# Altium schematic sheet F143-MINI-KIT-902-FE-SMA_v1-0-2b.SchDoc: F143-MINI-KIT-902-FE-SMA_v1-0-2b
size 555 x 399 mm; Date: 4/13/2017 9:06:14 PM; SheetNumber: 1; REV: 1-0-2b
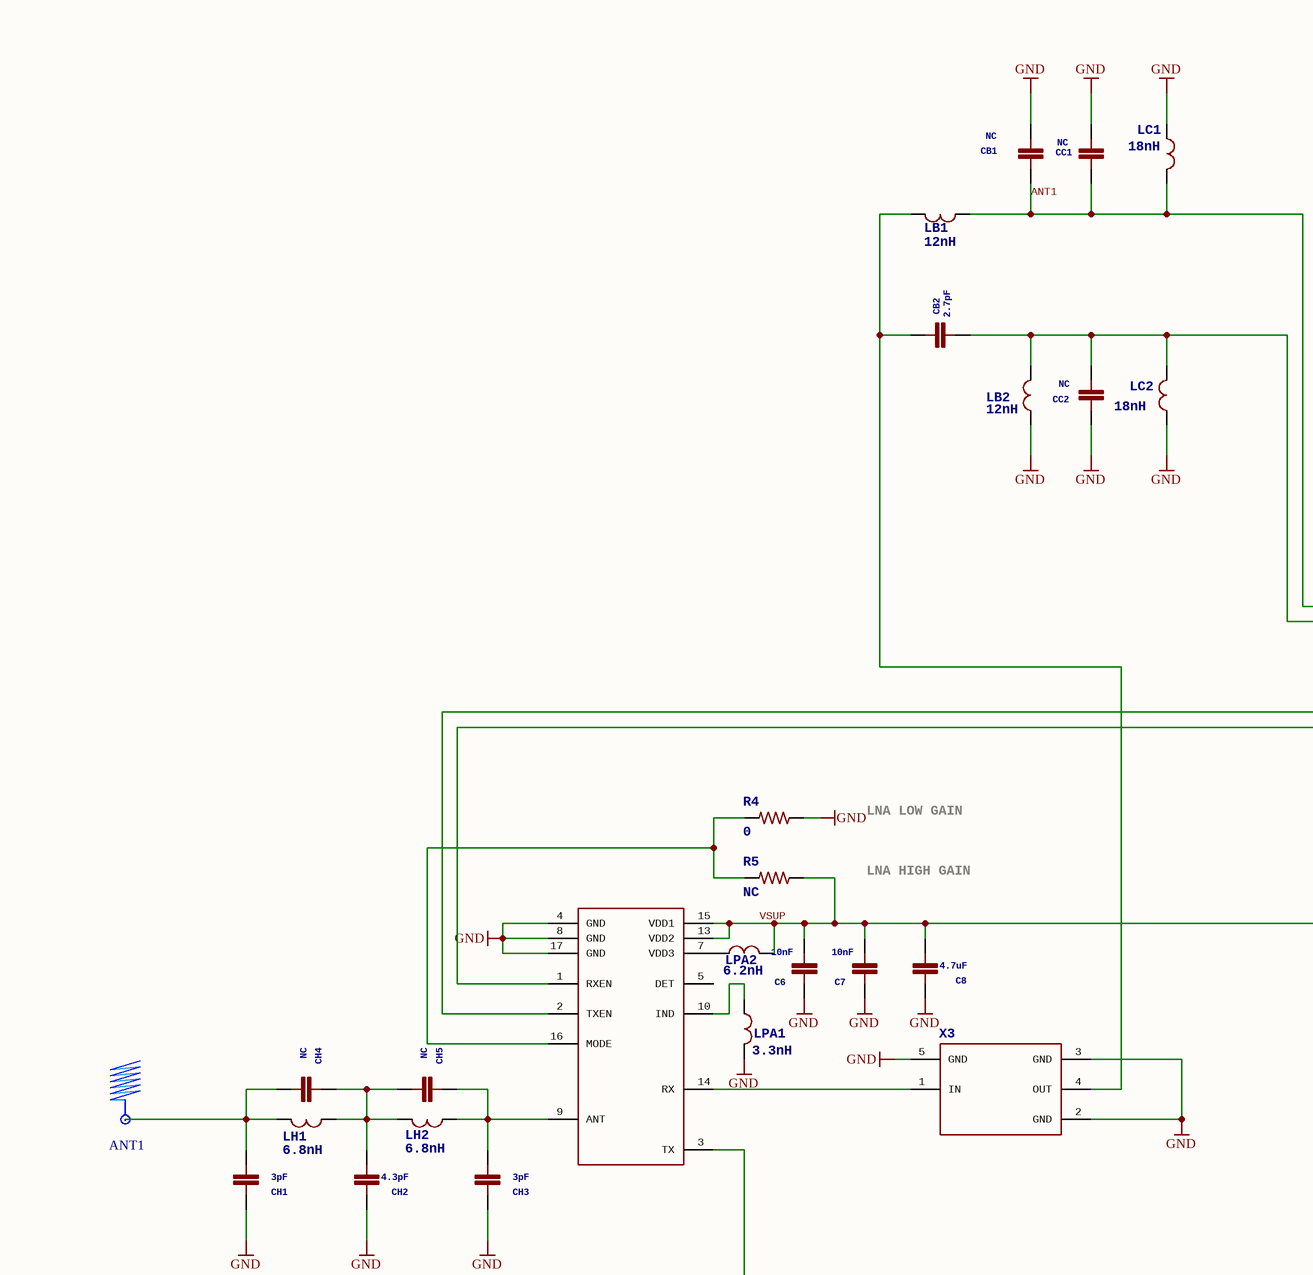
[diagram p0: F143-MINI-KIT-902-FE-SMA_v1-0-2b.SchDoc, top left]
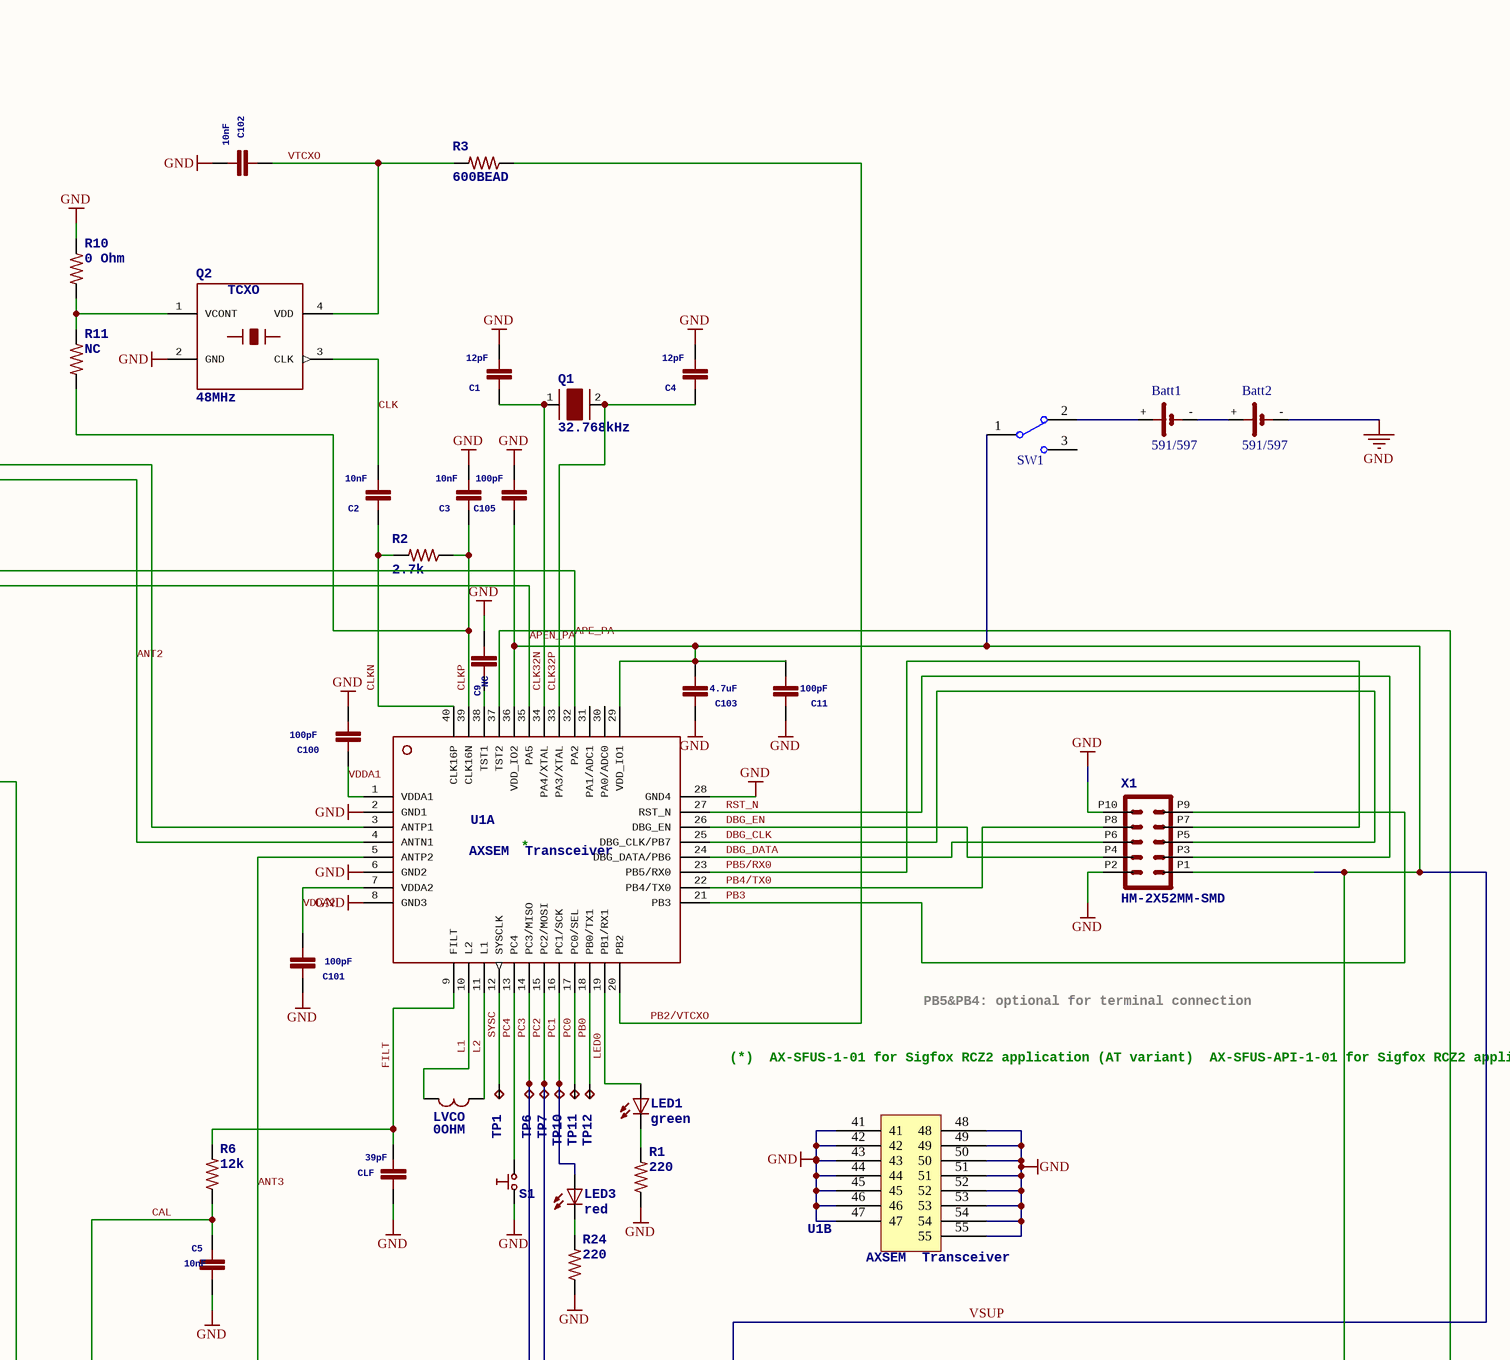
[diagram p1: F143-MINI-KIT-902-FE-SMA_v1-0-2b.SchDoc, top right]
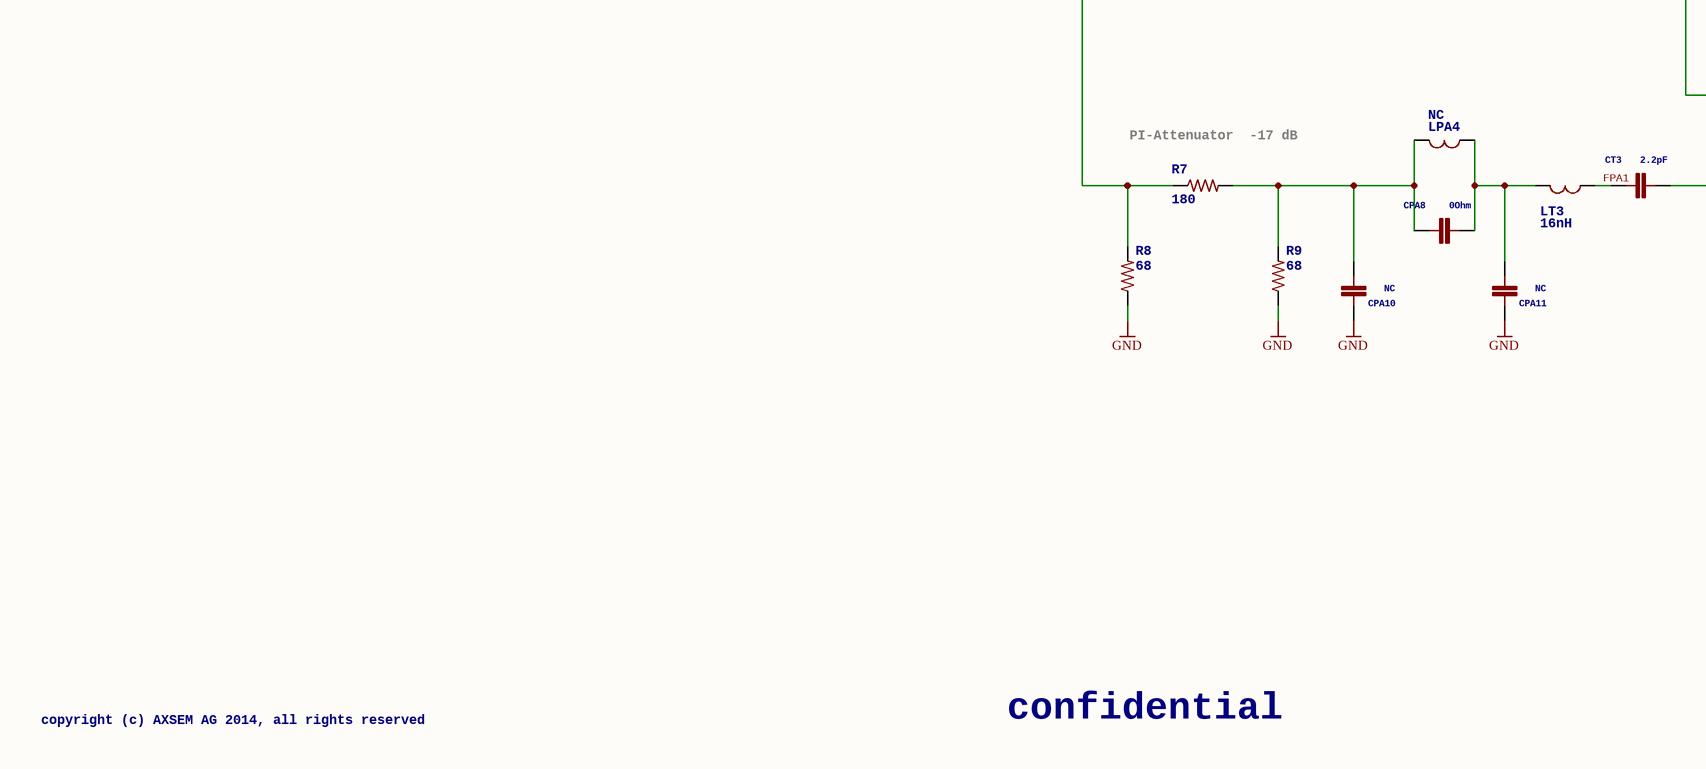
[diagram p2: F143-MINI-KIT-902-FE-SMA_v1-0-2b.SchDoc, bottom left]
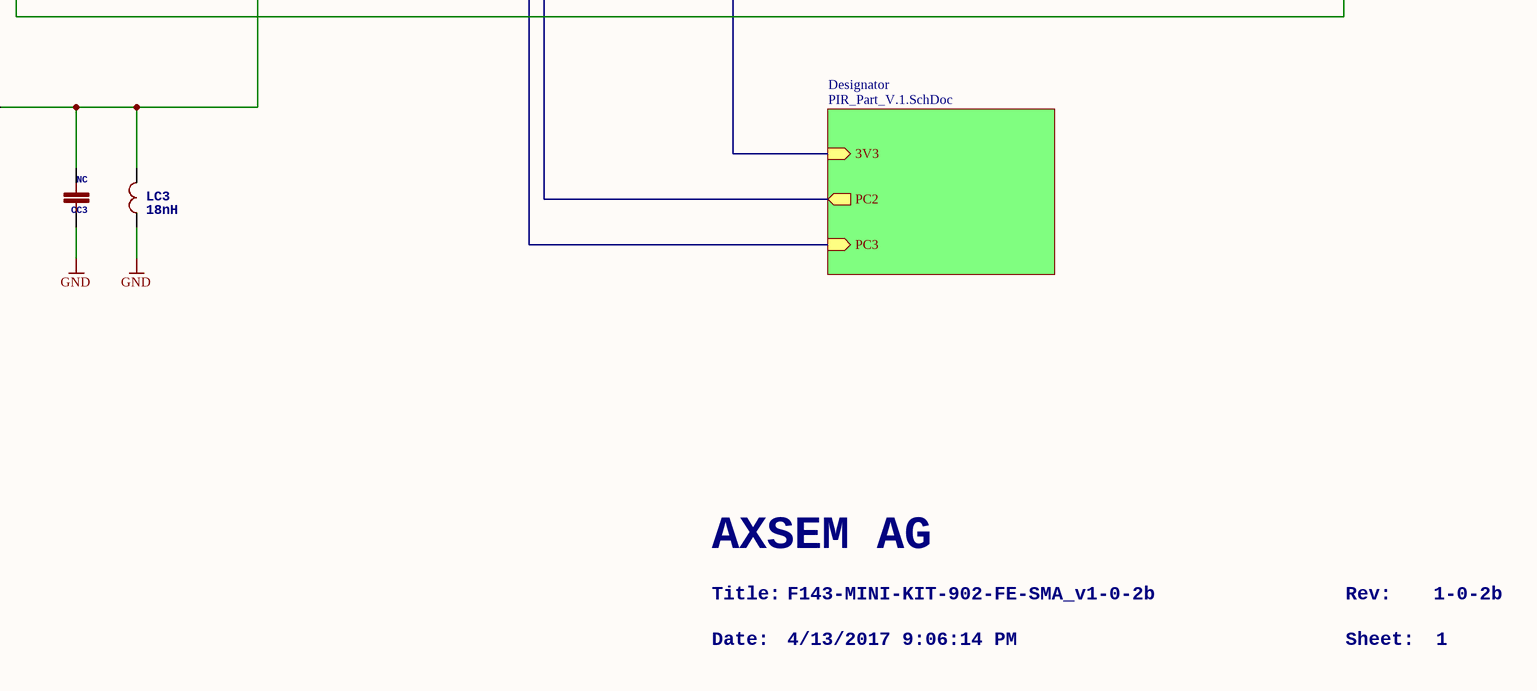
[diagram p3: F143-MINI-KIT-902-FE-SMA_v1-0-2b.SchDoc, bottom right]

## Parts
ANT1  SW868-TH13  [Spring Antenna]  (value not drawn)
Batt1  591/597  [Battery Clip AAA]
Batt2  591/597  [Battery Clip AAA]
C1  12pF  [C0402]
C2  10nF  [C0402]
C3  10nF  [C0402]
C4  12pF  [C0402]
C5  10nF  [C0402]
C6  10nF  [C0402]
C7  10nF  [C0402]
C8  4.7uF  [C0603]
C9  NC  [C0402]
C11  100pF  [C0402]
C100  100pF  [C0402]
C101  100pF  [C0402]
C102  10nF  [C0402]
C103  4.7uF  [C0603]
C105  100pF  [C0402]
CB1  NC  [C0402]
CB2  2.7pF  [C0402]
CC1  NC  [C0402]
CC2  NC  [C0402]
CC3  NC  [C0402]
CH1  3pF  [C0402]
CH2  4.3pF  [C0402]
CH3  3pF  [C0402]
CH4  NC  [C0402]
CH5  NC  [C0402]
CLF  39pF  [C0402]
CPA8  0Ohm  [C0402]
CPA10  NC  [C0402]
CPA11  NC  [C0402]
CT3  2.2pF  [C0402]
LB1  12nH  [L0402]
LB2  12nH  [L0402]
LC1  18nH  [L0402]
LC2  18nH  [L0402]
LC3  18nH  [L0402]
LED1  green  [LED0603]
LED3  red  [LED0603]
LH1  6.8nH  [L0402]
LH2  6.8nH  [L0402]
LPA1  3.3nH  [L0402]
LPA2  6.2nH  [L0402]
LPA4  NC  [L0402]
LT3  16nH  [L0402]
LVCO  0OHM  [L0402]
Q1  32.768kHz  [TF20]
Q2  48MHz  [X2016]
R1  220  [R0402]
R2  2.7k  [R0402]
R3  600BEAD  [R0402]
R4  0  [R0402]
R5  NC  [R0402]
R6  12k  [R0402]
R7  180  [R0402]
R8  68  [R0402]
R9  68  [R0402]
R10  0 Ohm  [R0402]
R11  NC  [R0402]
R24  220  [R0402]
S1  (no value)  [TASTER_SMALL_SMD_4PAD]
SW1  MS-22D01  [SW MS-22D01]  (value not drawn)
TP1  (no value)  [PIN-03]
TP6  (no value)  [PIN-03]
TP7  (no value)  [PIN-03]
TP10  (no value)  [PIN-03]
TP11  (no value)  [PIN-03]
TP12  (no value)  [PIN-03]
U1  AXSEM
Transceiver: AXSEM / Transceiver  [QFN40]  (hidden comment: SFUSN)  (parts A,B of 2)
U$2  (no value)  [QFN16_TH]
X1  HM-2X52MM-SMD  [HM-2MM-2X5-SMD]
X3  (no value)  [SAW_1.4X1.1X0.5]

## Sub-sheets
Designator = PIR_Part_V.1.SchDoc: 3V3 (in), PC2 (out), PC3 (in)

## Nets
GND: Batt2.- C1.1 C3.1 C4.1 C5.2 C6.2 C7.2 C8.2 C9.1 C11.2 C100.1 C101.2 C102.1 C103.2 C105.1 CB1.2 CC1.2 CC2.1 CC3.2 CH1.2 CH2.2 CH3.2 CLF.2 CPA10.2 CPA11.2 LB2.1 LC1.1 LC2.1 LC3.1 LPA1.2 Q2.2(GND) R1.3 R4.3 R8.3 R9.3 R10.3 R24.3 S1.P3 U1.2(GND1) U1.6(GND2) U1.8(GND3) U1.28(GND4) U1.41 U1.42 U1.43 U1.44 U1.45 U1.46 U1.47 U1.48 U1.49 U1.50 U1.51 U1.52 U1.53 U1.54 U1.55 U$2.4(GND) U$2.8(GND) U$2.17(GND) X1.P2 X1.P10 X3.2(GND) X3.3(GND) X3.5(GND)
ANT1: CB1.1 CC1.1 LB1.1 LC1.2 U1.3(ANTP1)
ANT2: CB2.2 CC2.2 LB2.2 LC2.2 U1.4(ANTN1)
ANT3: CC3.1 CT3.2 LC3.2 U1.5(ANTP2)
APE_PA: U1.32(PA2) U$2.2(TXEN)
APEN_PA: U1.35(PA5) U$2.1(RXEN)
CAL: C5.1 R6.3 U1.37(TST2)
CLK: C2.1 Q2.3(CLK)
CLK32N: C1.2 Q1.1(P1) U1.34(PA4/XTAL)
CLK32P: C4.2 Q1.2(P2) U1.33(PA3/XTAL)
CLKN: C2.2 R2.4 U1.40(CLK16P)
CLKP: C3.2 R2.3 R11.4 U1.39(CLK16N)
DBG_CLK: U1.25(DBG_CLK/PB7) X1.P5
DBG_DATA: U1.24(DBG_DATA/PB6) X1.P6
DBG_EN: U1.26(DBG_EN) X1.P4
FILT: CLF.1 R6.4 U1.9(FILT)
FPA1: CT3.1 LT3.1
L1: LVCO.2 U1.10(L2)
L2: LVCO.1 U1.11(L1)
LED0: LED1.A U1.19(PB1/RX1)
PB0: TP12.P$1(TP) U1.18(PB0/TX1)
PB2/VTCXO: R3.3 U1.20(PB2)
PB3: U1.21(PB3) X1.P9
PB4/TX0: U1.22(PB4/TX0) X1.P8
PB5/RX0: U1.23(PB5/RX0) X1.P7
PC0: TP11.P$1(TP) U1.17(PC0/SEL)
PC1: LED3.A TP10.P$1(TP) U1.16(PC1/SCK)
PC2: TP7.P$1(TP) U1.15(PC2/MOSI) ; sheet Designator/PC2
PC3: TP6.P$1(TP) U1.14(PC3/MISO) ; sheet Designator/PC3
PC4: S1.P1 U1.13(PC4)
RST_N: U1.27(RST_N) X1.P3
SYSC: TP1.P$1(TP) U1.12(SYSCLK)
VDDA1: C100.2 U1.1(VDDA1)
VDDA2: C101.1 U1.7(VDDA2)
VSUP: C6.1 C7.1 C8.1 C11.1 C103.1 C105.2 LPA2.2 R5.3 SW1.1 U1.29(VDD_IO1) U1.36(VDD_IO2) U$2.13(VDD2) U$2.15(VDD1) X1.P1 ; sheet Designator/3V3
VTCXO: C102.2 Q2.4(VDD) R3.4
NetANT1_0: ANT1.0 CH1.1 CH4.1 LH1.1
NetBatt1_+: Batt1.+ SW1.2
NetBatt1_-: Batt1.- Batt2.+
NetC9_2: C9.2 U1.38(TST1)
NetCB2_1: CB2.1 LB1.2 X3.4(OUT)
NetCH2_1: CH2.1 CH4.2 CH5.1 LH1.2 LH2.1
NetCH3_1: CH3.1 CH5.2 LH2.2 U$2.9(ANT)
NetCPA8_1: CPA8.1 CPA10.1 LPA4.1 R7.4 R9.4
NetCPA8_2: CPA8.2 CPA11.1 LPA4.2 LT3.2
NetLED1_C: LED1.C R1.4
NetLED3_C: LED3.C R24.4
NetLPA1_1: LPA1.1 U$2.10(IND)
NetLPA2_1: LPA2.1 U$2.7(VDD3)
NetQ2_1: Q2.1(VCONT) R10.4 R11.3
NetR4_4: R4.4 R5.4 U$2.16(MODE)
NetR7_3: R7.3 R8.4 U$2.3(TX)
NetU$2_14: U$2.14(RX) X3.1(IN)

Not connected (* = marked no-connect by the designer): SW1 3; U1 30(PA0/ADC0) 31(PA1/ADC1); U$2 5(DET)

## Notes on the sheet
- LNA LOW GAIN
- LNA HIGH GAIN
- (near U1) *
- PB5&PB4: optional for terminal connection
- (*)
  AX-SFUS-1-01 for Sigfox RCZ2 application (AT variant)
  AX-SFUS-API-1-01 for Sigfox RCZ2 application (API variant)
  AX8052F143 for general purpose (non Sigfox) application
- (near R7) PI-Attenuator
  -17 dB
- AXSEM AG
- copyright (c) AXSEM AG 2014, all rights reserved
- confidential
- Date:
- Title:
- 4/13/2017 9:06:14 PM
- F143-MINI-KIT-902-FE-SMA_v1-0-2b
- Rev:
- Sheet:
- 1-0-2b
- 1

## Library data of the parts
ANT1 = spring antenna 868MHz 50Ohms 5W: SW868-TH13 Antenna; Frequency: 868MHz; Type: Spring Antenna; Reference: SW868-TH13
Batt1 Batt2 = Battery holder  AAA Keystone 591/597: Batt Holder AAA Keystone 591/597; Manufaturer: Keystone; Model: 591/597; Type: Batt Holder AAA TH; Batt Size: AAA
C1-C7 C9 C11 C100-C102 C105 CB1 CB2 CC1-CC3 CH1-CH5 CLF CPA8 CPA10 CPA11 CT3 = C0402
C8 C103 = C0603
LB1 LB2 LC1-LC3 LH1 LH2 LPA1 LPA2 LPA4 LT3 LVCO = L0402
LED1 LED3 = LED0603
Q1 = XTAL-2PINTF20
Q2 = TCXO: TCXO: TCXO
R1-R11 R24 = R0402
S1 = TASTER4-PAD-SMD-SMALL: AXSEM tasters
SW1 = Slide Switch MS-22D01: Slide Switch MS-22D01 2P2T; Rating: DC 6V 300mA; Part: MS-22D01; Type: slide switch spdt; Circuit: 2P2T
TP1 TP6 TP7 TP10-TP12 = TP03: Test pad
U1 = SFUSN: AX-SFUS-1-01 for Sigfox RCZ2 application (AT variant), AX-SFUS-API-1-01 for Sigfox RCZ2 application (API variant), AX8052F143 for general purpose (non Sigfox) application
U$2 = RFX1010
X3 = WFC30A0915FE